# Altium project Z20X.PrjPcb
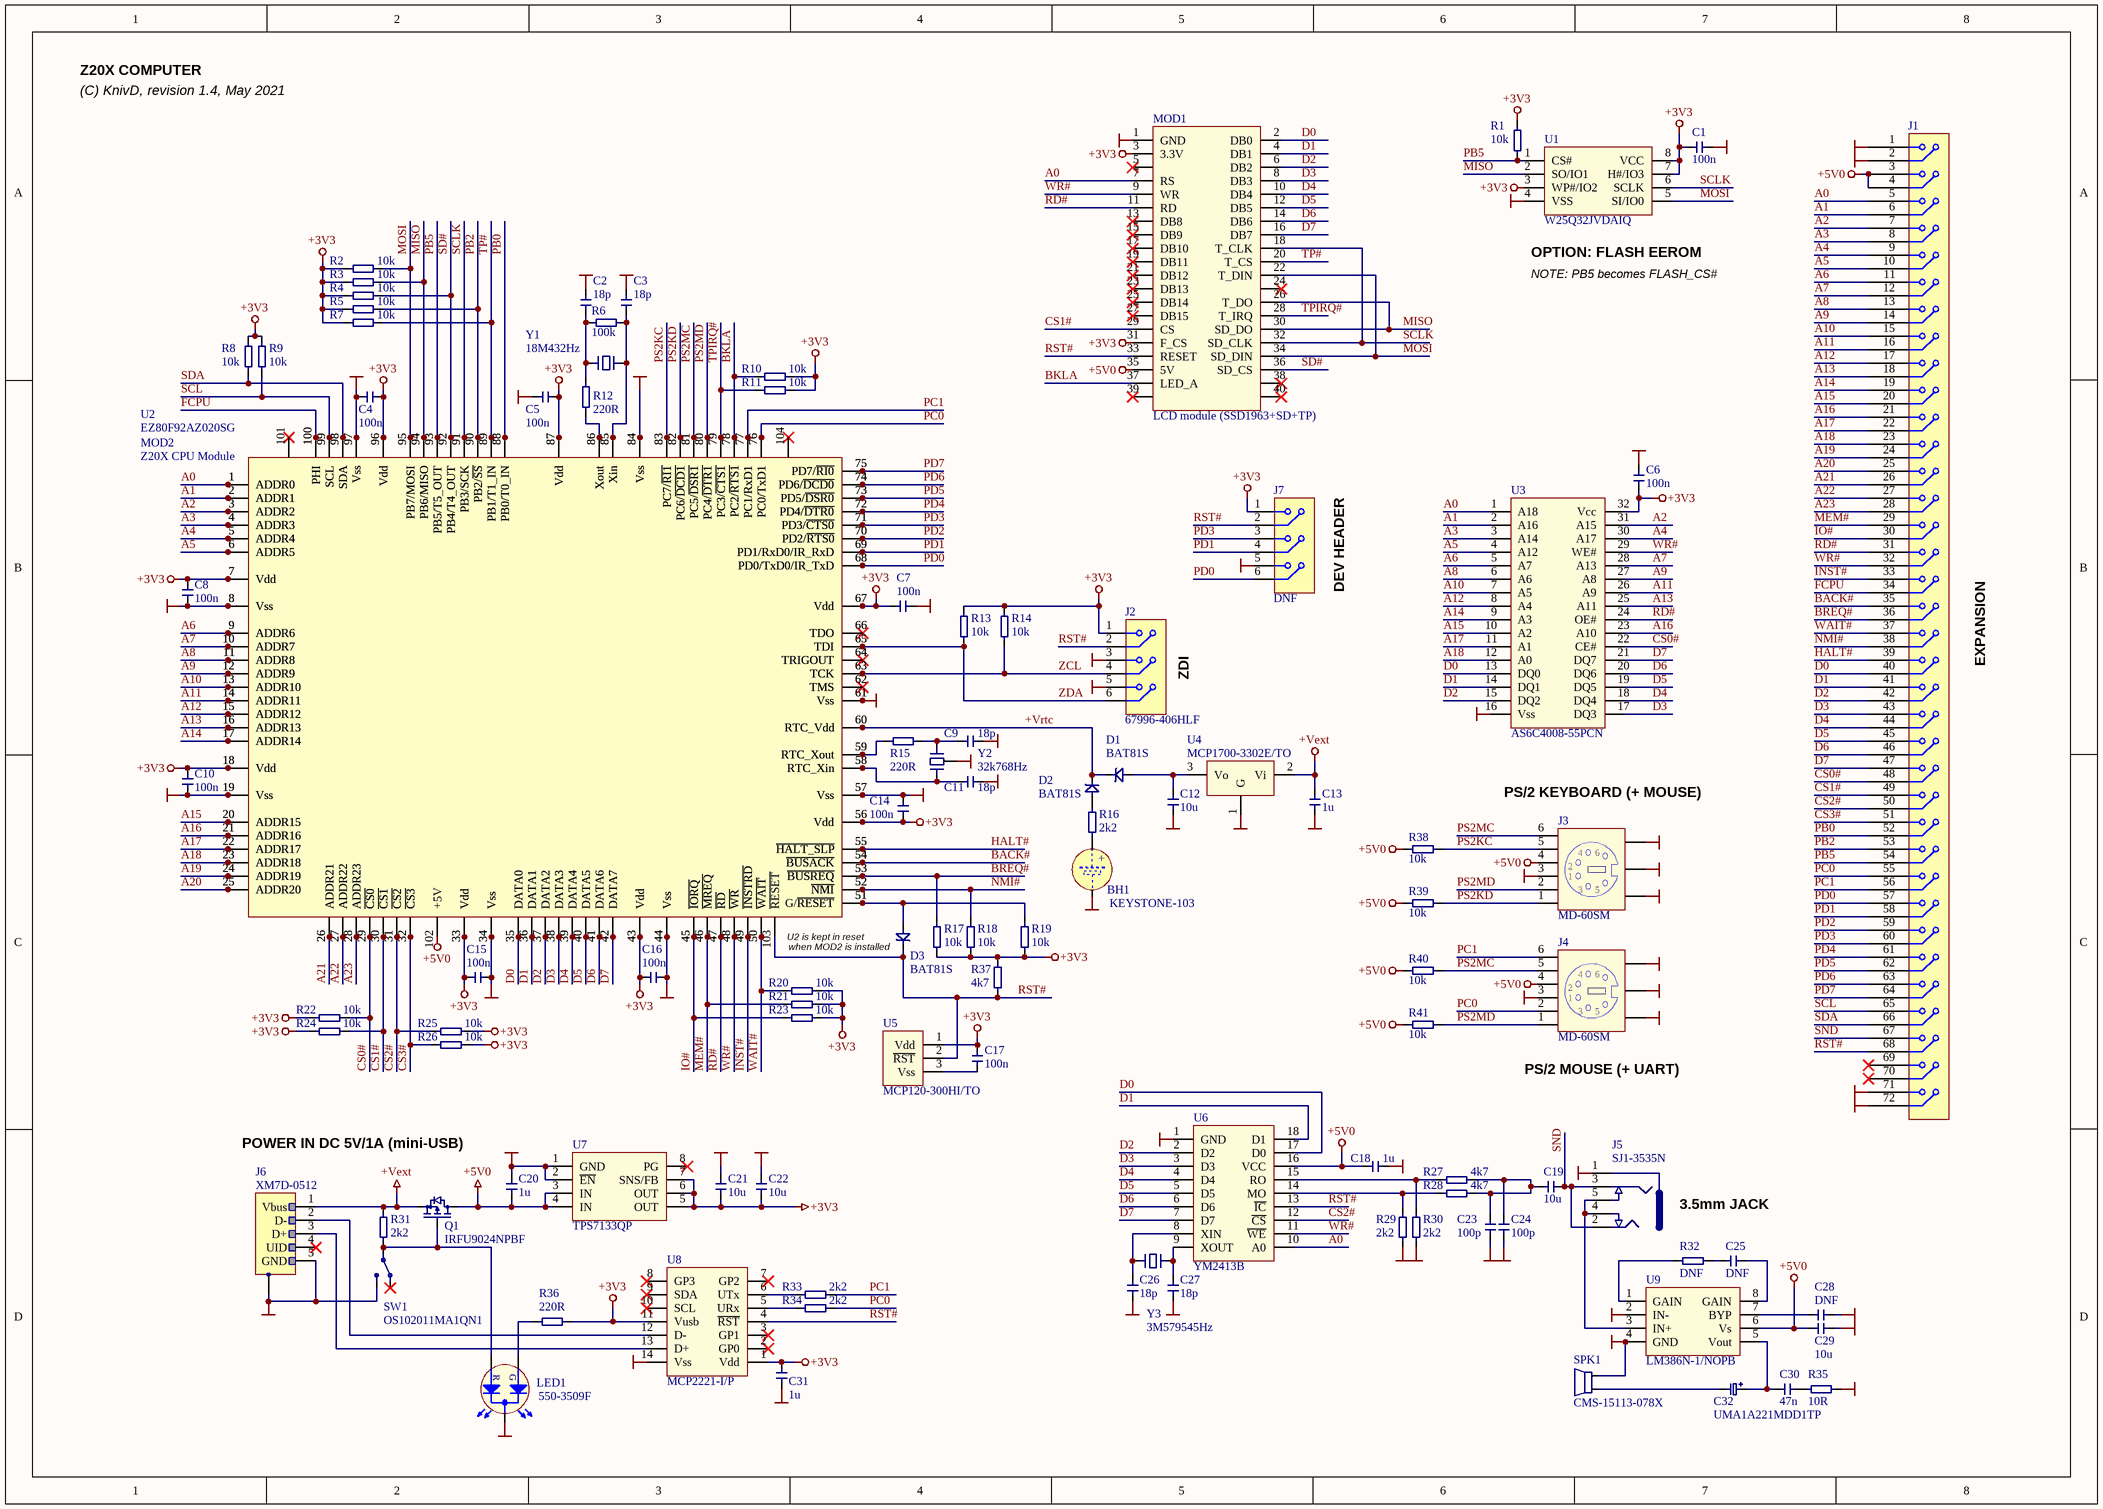
[diagram p0: main.SchDoc]
1 sheet, 102 parts. Net scope: global (net labels, ports and power ports of the same name join across sheets).
Board file: PCB.PcbDoc

## Sheet main.SchDoc: ELLO TROLL
size A3; Author: KnivD; DrawnBy: KnivD; Engineer: KnivD; DocumentNumber: 1; Revision: 1704; SheetNumber: 1; SheetTotal: 1; ProjectName: ELLO TROLL

### Parts
BH1  KEYSTONE-103  [BATH_KEYSTONE_103]
C1  100n  [CAPRR508-350X500X500]
C2  18p  [CAPRR508-350X500X500]
C3  18p  [CAPRR508-350X500X500]
C4  100n  [CAPRR508-350X500X500]
C5  100n  [CAPRR508-350X500X500]
C6  100n  [CAPRR508-350X500X500]
C7  100n  [CAPRR508-350X500X500]
C8  100n  [CAPRR508-350X500X500]
C9  18p  [CAPRR508-350X500X500]
C10  100n  [CAPRR508-350X500X500]
C11  18p  [CAPRR508-350X500X500]
C12  10u  [CAPRR508-350X500X500]
C13  1u  [CAPRR508-350X500X500]
C14  100n  [CAPRR508-350X500X500]
C15  100n  [CAPRR508-350X500X500]
C16  100n  [CAPRR508-350X500X500]
C17  100n  [CAPRR508-350X500X500]
C18  1u  [CAPRR508-350X500X500]
C19  10u  [CAPRR508-350X500X500]
C20  1u  [CAPRR508-350X500X500]
C21  10u  [CAPRR508-350X500X500]
C22  10u  [CAPRR508-350X500X500]
C23  100p  [CAPRR508-350X500X500]
C24  100p  [CAPRR508-350X500X500]
C25  DNF  [CAPRR508-350X500X500]
C26  18p  [CAPRR508-350X500X500]
C27  18p  [CAPRR508-350X500X500]
C28  DNF  [CAPRR508-350X500X500]
C29  10u  [CAPRR508-350X500X500]
C30  47n  [CAPRR508-350X500X500]
C31  1u  [CAPRR508-350X500X500]
C32  UMA1A221MDD1TP  [CAPPR350-850X600]
D1  BAT81S  [DO-35]
D2  BAT81S  [DO-35]
D3  BAT81S  [DO-35]
J1  (no value)  [DIL72-M-R]
J2  67996-406HLF  [SAMTEC_MTLW-103-07-L-D-250]
J3  MD-60SM  [MD-60SM]
J4  MD-60SM  [MD-60SM]
J5  SJ1-3535N  [SJ1-3535NG]
J6  XM7D-0512  [WURTH_651005136521]
J7  DNF  [SAMTEC_MTLW-103-07-L-D-250]
LED1  550-3509F  [LED_DIALIGHT_550-3509F]
MOD1  LCD module (SSD1963+SD+TP)  [LCD 7" SSD1963+RTP+SD]
MOD2  Z20X CPU Module  [PGA100X15]
Q1  IRFU9024NPBF  [TO-251AA-V]
R1  10k  [RES1016-660X250]
R2  10k  [RES1016-660X250]
R3  10k  [RES1016-660X250]
R4  10k  [RES1016-660X250]
R5  10k  [RES1016-660X250]
R6  100k  [RES1016-660X250]
R7  10k  [RES1016-660X250]
R8  10k  [RES1016-660X250]
R9  10k  [RES1016-660X250]
R10  10k  [RES1016-660X250]
R11  10k  [RES1016-660X250]
R12  220R  [RES1016-660X250]
R13  10k  [RES1016-660X250]
R14  10k  [RES1016-660X250]
R15  220R  [RES1016-660X250]
R16  2k2  [RES1016-660X250]
R17  10k  [RES1016-660X250]
R18  10k  [RES1016-660X250]
R19  10k  [RES1016-660X250]
R20  10k  [RES1016-660X250]
R21  10k  [RES1016-660X250]
R22  10k  [RES1016-660X250]
R23  10k  [RES1016-660X250]
R24  10k  [RES1016-660X250]
R25  10k  [RES1016-660X250]
R26  10k  [RES1016-660X250]
R27  4k7  [RES1016-660X250]
R28  4k7  [RES1016-660X250]
R29  2k2  [RES1016-660X250]
R30  2k2  [RES1016-660X250]
R31  2k2  [RES1016-660X250]
R32  DNF  [RES1016-660X250]
R33  2k2  [RES1016-660X250]
R34  2k2  [RES1016-660X250]
R35  10R  [RES1016-660X250]
R36  220R  [RES1016-660X250]
R37  4k7  [RES1016-660X250]
R38  10k  [RES1016-660X250]
R39  10k  [RES1016-660X250]
R40  10k  [RES1016-660X250]
R41  10k  [RES1016-660X250]
SPK1  CMS-15113-078X  [2011-1X02S]
SW1  OS102011MA1QN1  [OS102011MA1QN1]
U1  W25Q32JVDAIQ  [DIP8-300]
U2  EZ80F92AZ020SG  [QFP50P1600X1600X170-100N]
U3  AS6C4008-55PCN  [DIP32]
U4  MCP1700-3302E/TO  [TO-92AA-P254]
U5  MCP120-300HI/TO  [TO-92AA-P254]
U6  YM2413B  [DIP18-300]
U7  TPS7133QP  [DIP8-300]
U8  MCP2221-I/P  [DIP14-300]
U9  LM386N-1/NOPB  [DIP8-300]
Y1  Note: 18M432Hz  [XTAL_HC-49/U]  (hidden comment: 9B-18.432MAAJ-B)
Y2  Note: 32k768Hz  [CRYSTAL_32768Hz]  (hidden comment: AB26T-32.768KHZ)
Y3  Note: 3M579545Hz  [XTAL_HC-49/U]  (hidden comment: 9B-3.579545MAAJ-B)

### Nets
+3V3: C1.1 C4.2 C5.1 C6.2 C7.1 C8.2 C10.2 C14.2 C15.2 C16.2 C17.1 C21.1 C22.1 C31.1 J2.1 J7.1 MOD1.3(3.3V) MOD1.31(F_CS) MOD2.7(Vdd) MOD2.18(Vdd) MOD2.33(Vdd) MOD2.43(Vdd) MOD2.56(Vdd) MOD2.67(Vdd) MOD2.87(Vdd) MOD2.96(Vdd) R1.1 R2.2 R3.2 R4.2 R5.2 R7.2 R8.1 R9.1 R10.1 R11.1 R13.1 R14.1 R17.2 R18.2 R19.2 R20.2 R21.2 R22.1 R23.2 R24.1 R25.1 R26.1 R36.2 R37.2 U1.3(WP#/IO2) U1.7(H#/IO3) U1.8(VCC) U2.7(Vdd) U2.18(Vdd) U2.33(Vdd) U2.43(Vdd) U2.56(Vdd) U2.67(Vdd) U2.87(Vdd) U2.96(Vdd) U3.32(Vcc) U5.1(Vdd) U7.5(OUT) U7.6(OUT) U7.7(SNS/FB) U8.1(Vdd) U8.11(Vusb)
+5V0: C18.1 C20.1 C29.1 J1.3 J1.4 J3.4 J4.4 MOD1.35(5V) MOD2.102(+5V) Q1.2 R38.2 R39.2 R40.2 R41.2 U6.16(VCC) U7.3(IN) U7.4(IN) U9.6(Vs)
+Vext: C13.2 J6.1(Vbus) Q1.3 R31.1 U4.2(Vi)
GND: BH1.2(MINUS) C1.2 C2.1 C3.1 C4.1 C5.2 C6.1 C7.2 C8.1 C9.1 C10.1 C11.1 C12.1 C13.1 C14.1 C15.1 C16.1 C18.2 C20.2 C21.2 C22.2 C23.1 C24.1 C26.2 C27.2 C28.2 C29.2 C31.2 J1.1 J1.2 J1.71 J1.72 J2.3 J2.5 J3.0 J3.3 J4.0 J4.3 J5.1 J6.5(GND) J6.6(SH) J7.5 LED1.2(CC) MOD1.1(GND) MOD2.8(Vss) MOD2.19(Vss) MOD2.34(Vss) MOD2.44(Vss) MOD2.57(Vss) MOD2.61(Vss) MOD2.84(Vss) MOD2.97(Vss) R29.2 R30.2 R35.2 SPK1.2 SW1.1 U1.4(VSS) U2.8(Vss) U2.19(Vss) U2.34(Vss) U2.44(Vss) U2.57(Vss) U2.61(Vss) U2.84(Vss) U2.97(Vss) U3.16(Vss) U4.1(G) U6.1(GND) U7.1(GND) U7.2(~{EN}) U8.14(Vss) U9.2(IN-) U9.4(GND) Y2.0
+Vrtc: D1.1 D2.1 MOD2.60(RTC_Vdd) U2.60(RTC_Vdd)
A0: J1.5 MOD1.7(RS) MOD2.1(ADDR0) U2.1(ADDR0) U3.1(A18) U6.10(A0)
A1: J1.6 MOD2.2(ADDR1) U2.2(ADDR1) U3.2(A16)
A2: J1.7 MOD2.3(ADDR2) U2.3(ADDR2) U3.31(A15)
A3: J1.8 MOD2.4(ADDR3) U2.4(ADDR3) U3.3(A14)
A4: J1.9 MOD2.5(ADDR4) U2.5(ADDR4) U3.30(A17)
A5: J1.10 MOD2.6(ADDR5) U2.6(ADDR5) U3.4(A12)
A6: J1.11 MOD2.9(ADDR6) U2.9(ADDR6) U3.5(A7)
A7: J1.12 MOD2.10(ADDR7) U2.10(ADDR7) U3.28(A13)
A8: J1.13 MOD2.11(ADDR8) U2.11(ADDR8) U3.6(A6)
A9: J1.14 MOD2.12(ADDR9) U2.12(ADDR9) U3.27(A8)
A10: J1.15 MOD2.13(ADDR10) U2.13(ADDR10) U3.7(A5)
A11: J1.16 MOD2.14(ADDR11) U2.14(ADDR11) U3.26(A9)
A12: J1.17 MOD2.15(ADDR12) U2.15(ADDR12) U3.8(A4)
A13: J1.18 MOD2.16(ADDR13) U2.16(ADDR13) U3.25(A11)
A14: J1.19 MOD2.17(ADDR14) U2.17(ADDR14) U3.9(A3)
A15: J1.20 MOD2.20(ADDR15) U2.20(ADDR15) U3.10(A2)
A16: J1.21 MOD2.21(ADDR16) U2.21(ADDR16) U3.23(A10)
A17: J1.22 MOD2.22(ADDR17) U2.22(ADDR17) U3.11(A1)
A18: J1.23 MOD2.23(ADDR18) U2.23(ADDR18) U3.12(A0)
A19: J1.24 MOD2.24(ADDR19) U2.24(ADDR19)
A20: J1.25 MOD2.25(ADDR20) U2.25(ADDR20)
A21: J1.26 MOD2.26(ADDR21) U2.26(ADDR21)
A22: J1.27 MOD2.27(ADDR22) U2.27(ADDR22)
A23: J1.28 MOD2.28(ADDR23) U2.28(ADDR23)
BACK#: J1.35 MOD2.54(~{BUSACK}) U2.54(~{BUSACK})
BKLA: MOD1.37(LED_A) MOD2.78(PC2/~{RTS1}) R10.2 U2.78(PC2/~{RTS1})
BREQ#: J1.36 MOD2.53(~{BUSREQ}) R17.1 U2.53(~{BUSREQ})
CS0#: J1.48 MOD2.29(~{CS0}) R22.2 U2.29(~{CS0}) U3.22(CE#)
CS1#: J1.49 MOD1.29(CS) MOD2.30(~{CS1}) R24.2 U2.30(~{CS1})
CS2#: J1.50 MOD2.31(~{CS2}) R25.2 U2.31(~{CS2}) U6.12(~{CS})
CS3#: J1.51 MOD2.32(~{CS3}) R26.2 U2.32(~{CS3})
D0: J1.40 MOD1.2(DB0) MOD2.35(DATA0) U2.35(DATA0) U3.13(DQ0) U6.17(D0)
D1: J1.41 MOD1.4(DB1) MOD2.36(DATA1) U2.36(DATA1) U3.14(DQ1) U6.18(D1)
D2: J1.42 MOD1.6(DB2) MOD2.37(DATA2) U2.37(DATA2) U3.15(DQ2) U6.2(D2)
D3: J1.43 MOD1.8(DB3) MOD2.38(DATA3) U2.38(DATA3) U3.17(DQ3) U6.3(D3)
D4: J1.44 MOD1.10(DB4) MOD2.39(DATA4) U2.39(DATA4) U3.18(DQ4) U6.4(D4)
D5: J1.45 MOD1.12(DB5) MOD2.40(DATA5) U2.40(DATA5) U3.19(DQ5) U6.5(D5)
D6: J1.46 MOD1.14(DB6) MOD2.41(DATA6) U2.41(DATA6) U3.20(DQ6) U6.6(D6)
D7: J1.47 MOD1.16(DB7) MOD2.42(DATA7) U2.42(DATA7) U3.21(DQ7) U6.7(D7)
FCPU: J1.34 MOD2.100(PHI) U2.100(PHI)
HALT#: J1.39 MOD2.55(~{HALT_SLP}) U2.55(~{HALT_SLP})
INST#: J1.33 MOD2.49(~{INSTRD}) U2.49(~{INSTRD})
IO#: J1.30 MOD2.45(~{IORQ}) R23.1 U2.45(~{IORQ})
MEM#: J1.29 MOD2.46(~{MREQ}) R21.1 U2.46(~{MREQ})
MISO: MOD1.26(T_DO) MOD1.30(SD_DO) MOD2.94(PB6/MISO) R3.1 U1.2(SO/IO1) U2.94(PB6/MISO)
MOSI: MOD1.22(T_DIN) MOD1.34(SD_DIN) MOD2.95(PB7/MOSI) R2.1 U1.5(SI/IO0) U2.95(PB7/MOSI)
NMI#: J1.38 MOD2.52(~{NMI}) R18.1 U2.52(~{NMI})
PB0: J1.52 MOD2.88(PB0/T0_IN) U2.88(PB0/T0_IN)
PB2: J1.53 MOD2.90(PB2/~{SS}) R5.1 U2.90(PB2/~{SS})
PB5: J1.54 MOD2.93(PB5/T5_OUT) R1.2 U1.1(CS#) U2.93(PB5/T5_OUT)
PC0: J1.55 J4.2 MOD2.76(PC0/TxD1) R34.2 U2.76(PC0/TxD1)
PC1: J1.56 J4.6 MOD2.77(PC1/RxD1) R33.2 U2.77(PC1/RxD1)
PD0: J1.57 J7.6 MOD2.68(PD0/TxD0/IR_TxD) U2.68(PD0/TxD0/IR_TxD)
PD1: J1.58 J7.4 MOD2.69(PD1/RxD0/IR_RxD) U2.69(PD1/RxD0/IR_RxD)
PD2: J1.59 MOD2.70(PD2/~{RTS0}) U2.70(PD2/~{RTS0})
PD3: J1.60 J7.3 MOD2.71(PD3/~{CTS0}) U2.71(PD3/~{CTS0})
PD4: J1.61 MOD2.72(PD4/~{DTR0}) U2.72(PD4/~{DTR0})
PD5: J1.62 MOD2.73(PD5/~{DSR0}) U2.73(PD5/~{DSR0})
PD6: J1.63 MOD2.74(PD6/~{DCD0}) U2.74(PD6/~{DCD0})
PD7: J1.64 MOD2.75(PD7/~{RI0}) U2.75(PD7/~{RI0})
PS2KC: J3.5 MOD2.83(PC7/~{RI1}) R38.1 U2.83(PC7/~{RI1})
PS2KD: J3.1 MOD2.82(PC6/~{DCD1}) R39.1 U2.82(PC6/~{DCD1})
PS2MC: J3.6 J4.5 MOD2.81(PC5/~{DSR1}) R40.1 U2.81(PC5/~{DSR1})
PS2MD: J3.2 J4.1 MOD2.80(PC4/~{DTR1}) R41.1 U2.80(PC4/~{DTR1})
RD#: J1.31 MOD1.11(RD) MOD2.47(~{RD}) U2.47(~{RD}) U3.24(OE#)
RST#: D3.1 J1.68 J2.2 J7.2 MOD1.33(RESET) MOD2.103(~{RESET}) R37.1 U5.2(~{RST}) U6.13(~{IC}) U8.4(~{RST})
SCL: J1.65 MOD2.99(SCL) R9.2 U2.99(SCL)
SCLK: MOD1.18(T_CLK) MOD1.32(SD_CLK) MOD2.91(PB3/SCK) U1.6(SCLK) U2.91(PB3/SCK)
SD#: MOD1.36(SD_CS) MOD2.92(PB4/T4_OUT) R4.1 U2.92(PB4/T4_OUT)
SDA: J1.66 MOD2.98(SDA) R8.2 U2.98(SDA)
SND: C19.2 J1.67 J5.2 J5.3
TP#: MOD1.20(T_CS) MOD2.89(PB1/T1_IN) R7.1 U2.89(PB1/T1_IN)
TPIRQ#: MOD1.28(T_IRQ) MOD2.79(PC3/~{CTS1}) R11.2 U2.79(PC3/~{CTS1})
WAIT#: J1.37 MOD2.50(~{WAIT}) R20.1 U2.50(~{WAIT})
WR#: J1.32 MOD1.9(WR) MOD2.48(~{WR}) U2.48(~{WR}) U3.29(WE#) U6.11(~{WE})
ZCL: J2.4 MOD2.63(TCK) R14.2 U2.63(TCK)
ZDA: J2.6 MOD2.65(TDI) R13.2 U2.65(TDI)
NetBH1_1: BH1.1(PLUS) R16.1
NetC2_2: C2.2 R6.2 R12.2 Y1.1
NetC3_2: C3.2 MOD2.85(Xin) R6.1 U2.85(Xin) Y1.2
NetC9_2: C9.2 R15.2 Y2.1
NetC11_2: C11.2 MOD2.58(RTC_Xin) U2.58(RTC_Xin) Y2.2
NetC12_2: C12.2 D1.2 U4.3(Vo)
NetC17_2: C17.2 U5.3(Vss)
NetC19_1: C19.1 C23.2 C24.2 R27.2 R28.2
NetC25_1: C25.1 U9.8(GAIN)
NetC25_2: C25.2 R32.2
NetC26_1: C26.1 U6.8(XIN) Y3.1
NetC27_1: C27.1 U6.9(XOUT) Y3.2
NetC28_1: C28.1 U9.7(BYP)
NetC30_1: C30.1 R35.1
NetC30_2: C30.2 C32.1 U9.5(Vout)
NetC32_2: C32.2 SPK1.1
NetD2_2: D2.2 R16.2
NetD3_2: D3.2 MOD2.51(G/~{RESET}) R19.1 U2.51(~{RESET})
NetJ5_4: J5.4 J5.5 U9.3(IN+)
NetJ6_2: J6.2(D-) U8.12(D-)
NetJ6_3: J6.3(D+) U8.13(D+)
NetLED1_1: LED1.1(AR) Q1.1 R31.2 SW1.2
NetLED1_3: LED1.3(AG) R36.1
NetMOD2_59: MOD2.59(RTC_Xout) R15.1 U2.59(RTC_Xout)
NetMOD2_62: MOD2.62(TMS) U2.62(TMS)
NetMOD2_64: MOD2.64(TRIGOUT) U2.64(TRIGOUT)
NetMOD2_66: MOD2.66(TDO) U2.66(TDO)
NetMOD2_86: MOD2.86(Xout) R12.1 U2.86(Xout)
NetR27_1: R27.1 R30.1 U6.15(RO)
NetR28_1: R28.1 R29.1 U6.14(MO)
NetR32_1: R32.1 U9.1(GAIN)
NetR33_1: R33.1 U8.6(UTx)
NetR34_1: R34.1 U8.5(URx)

Not connected (* = marked no-connect by the designer): J1 69* 70*; J6 4(UID)*; MOD1 5* 13(DB8)* 15(DB9)* 17(DB10)* 19(DB11)* 21(DB12)* 23(DB13)* 24* 25(DB14)* 27(DB15)* 38* 39* 40*; MOD2 101* 104*; SW1 3*; U7 8(PG)*; U8 2(GP0)* 3(GP1)* 7(GP2)* 8(GP3)* 9(SDA)* 10(SCL)*

### Notes on the sheet
- Z20X COMPUTER
- (C) KnivD, revision 1.4, May 2021
- (near U1) OPTION: FLASH EEROM
- NOTE: PB5 becomes FLASH_CS#
- DEV HEADER
- (near J2) ZDI
- EXPANSION
- (near J3) PS/2 KEYBOARD (+ MOUSE)
- U2 is kept in reset
- (near D3) when MOD2 is installed
- (near J4) PS/2 MOUSE (+ UART)
- POWER IN DC 5V/1A (mini-USB)
- 3.5mm JACK
- (in symbol BATH_KEYSTONE_103) +
- (in symbol LED_DIALIGHT_550-3509F) R; G

### Library data of the parts
BH1 = BATH_KEYSTONE_103: Battery holder for 20mm coin; Author: CERN DEM JLC
C1-C31 = Capacitor
C32 = Capacitor+: Polar capacitor; Note: 220u/10V
D1-D3 = Diode Schottky: Schottky diode
J1 = Connector 2x36: Dual row, 72-way connector
J2 J7 = Connector 2x3: Dual row, 6-way connector
J3 J4 = MD-60SM: 6-pin mini-DIN connector (female) PS/2
J5 = Phono Jack Stereo (switchless): Phono Jack (stereo)
J6 = Mini/Micro USB: MicroUSB type A/B, 5 Position SMT Right Angle Receptacle
LED1 = LED_DIALIGHT_550-3509F: Bicolor Red/Green  LED 1 Anode Red 2 Com Cathode 3 Anode Green; Author: CERN DEM JMW
MOD1 = LCD module (SSD1963+SD+RTP)
Q1 = P-FET: P-channel FET transistor
R1-R41 = Resistor
SPK1 = Speaker: Speaker/Buzzer
SW1 = Switch SPDT: Switch
U1 = GD25Q64C: 3.3V Uniform Sector 64Mbit Dual and Quad Serial Flash
U2 = eZ80F92/93: eZ80Acclaim!® Flash Microcontrollers; Manufacturer: Zilog; Variant: 80F92 (128K Flash, 8K RAM); 80F93 (64K Flash, 4K RAM)
U3 = AS6C4008: 512K X 8 BIT LOW POWER CMOS SRAM; Manufacturer: Alliance Semiconductor; Package: SOIC, DIP
U4 = 78Lxx: 3-terminal 250mA positive voltage regulator; Manufacturer: Microchip
U5 = MCP100: Microcontroller supervisory circuit with push-pull output; Manufacturer: Microchip
U6 = YM2413B: OPLL FM Operator Type-LL; Manufacturer: Yamaha
U7 = TPS71xx: 500mA low drop-out linear regulator; Manufacturer: Texas Instruments; Options: 7101 (Adj 1.2-9.75); 7133 (3.3); 7148 (4.85); 7150 (5.0); Package: QP (DIP); QD (SOIC)
U8 = MCP2221A: Manufacturer: Microchip
U9 = LM386: Low Voltage Audio Power Amplifier
Y1 Y3 = Crystal: Crystal Resonator
Y2 = Crystal (ground): Crystal Resonator